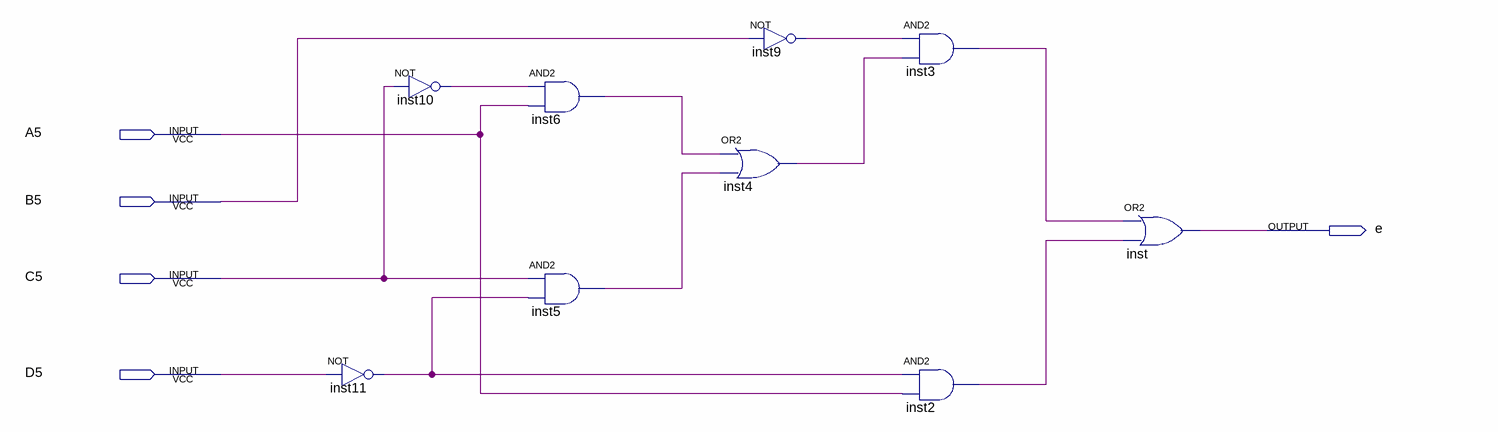
[diagram p0: schematic sheet]
// Quartus schematic Segment_e.bdf as structural Verilog: 9 symbols, 5 pins
module Segment_e (
  input  A5,
  input  B5,
  input  C5,
  input  D5,
  output e
);

  wire inst2_out, inst3_out, inst4_out, inst5_out, inst6_out, inst9_out, inst10_out, inst11_out;

  not inst11 (inst11_out, D5);
  not inst10 (inst10_out, C5);
  and inst6 (inst6_out, inst10_out, A5);
  and inst5 (inst5_out, C5, inst11_out);
  not inst9 (inst9_out, B5);
  or inst4 (inst4_out, inst6_out, inst5_out);
  and inst3 (inst3_out, inst9_out, inst4_out);
  and inst2 (inst2_out, inst11_out, A5);
  or inst (e, inst3_out, inst2_out);
endmodule
